# EAGLE design WifiBoxPCB (EAGLE 9.2.2)
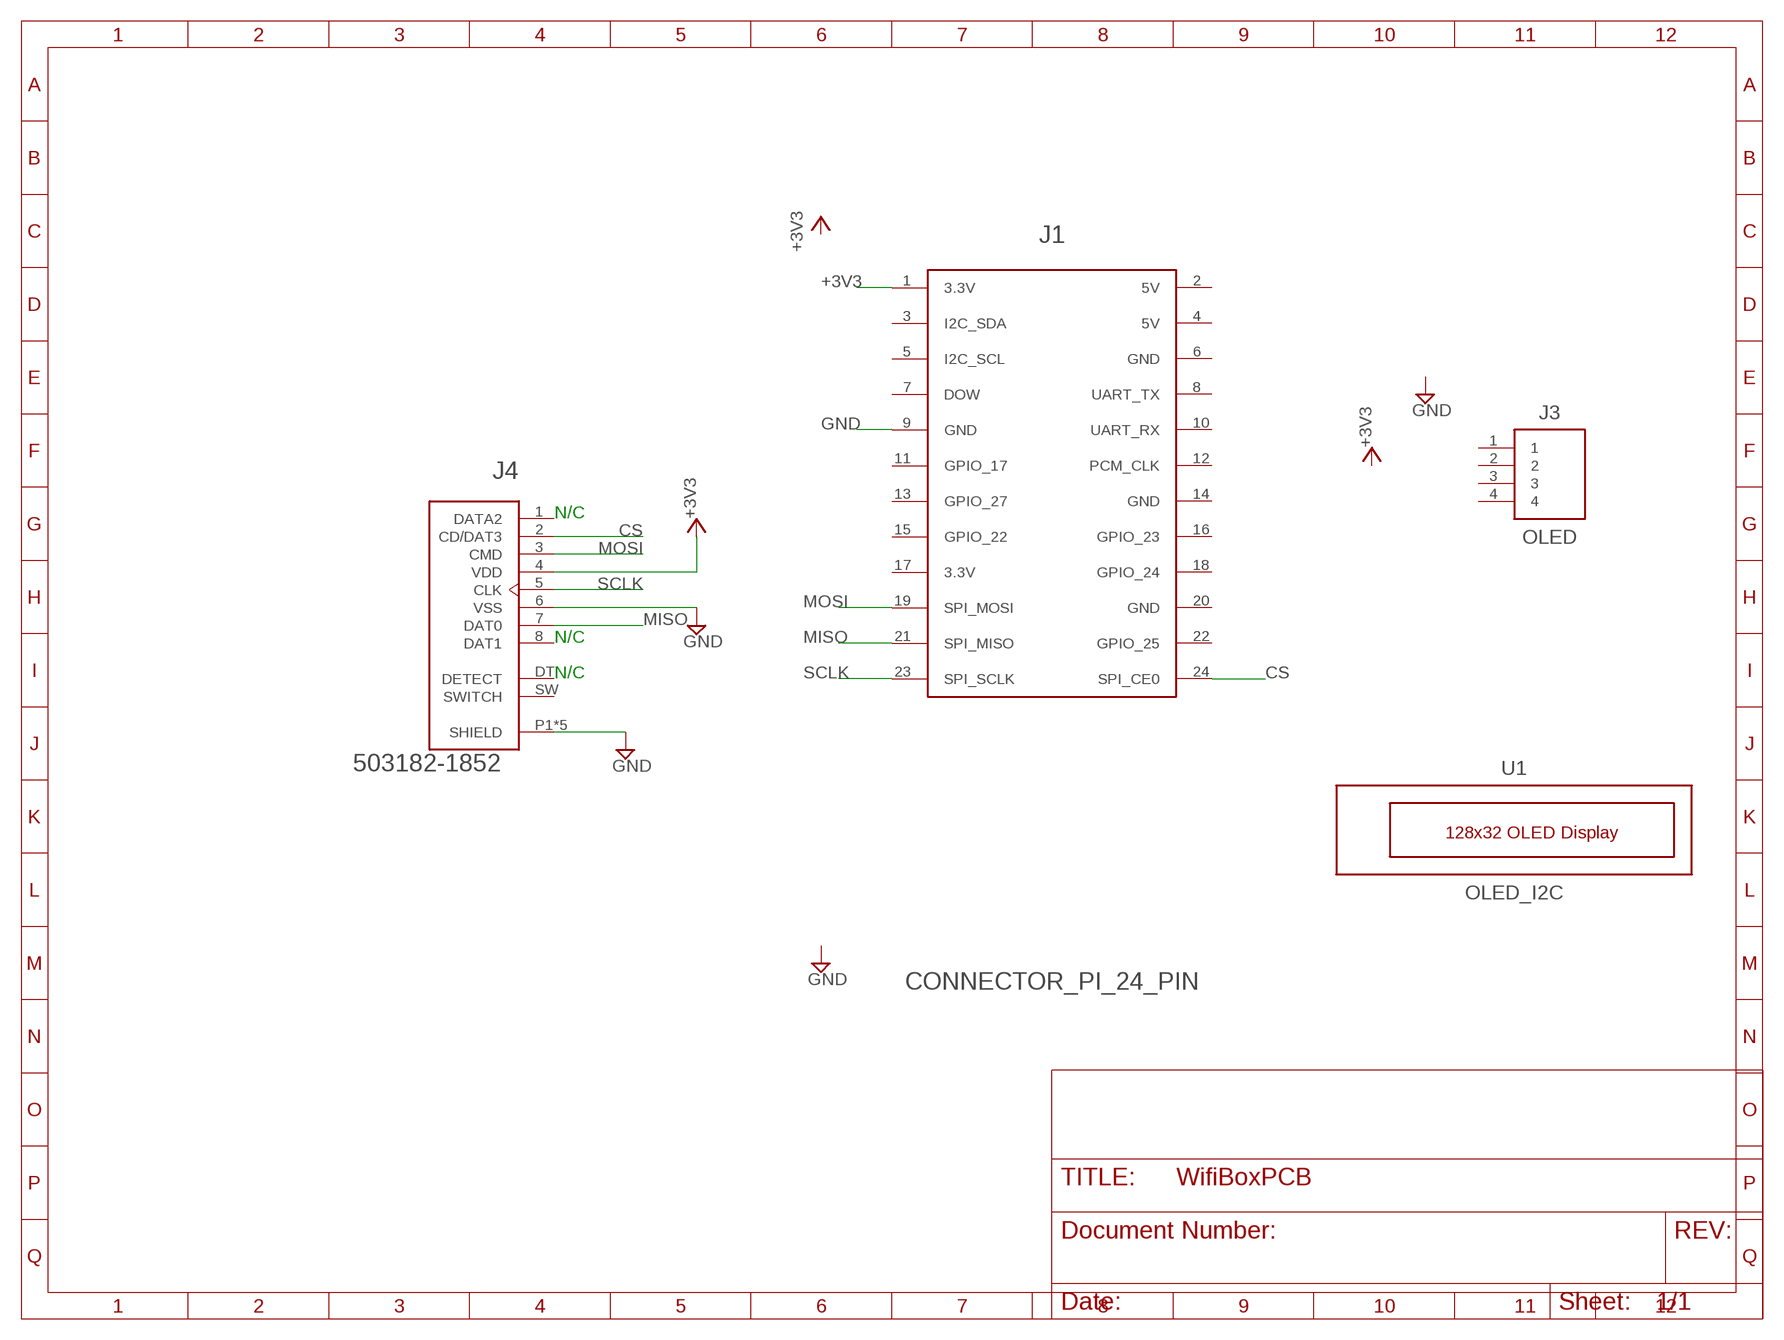
[diagram p0: schematic, sheet 1]

## Parts
J1  CONNECTOR_PI_24_PIN  [2X12]
J3  OLED  CONNECTOR_4  [ESQ-104-XX-X-S]
J4  503182-1852  [MOLEX_503182-1852]
U1  OLED_I2C  [OLED-I2C]

## Nets
+3V3: J1.1(3.3V) J4.4(VDD)
CS: J1.24(SPI_CE0) J4.2(CD/DAT3)
GND: J1.9(GND) J4.6(VSS) J4.P1(SHIELD) J4.P2(SHIELD) J4.P3(SHIELD) J4.P4(SHIELD) J4.P5(SHIELD)
MISO: J1.21(SPI_MISO) J4.7(DAT0)
MOSI: J1.19(SPI_MOSI) J4.3(CMD)
SCLK: J1.23(SPI_SCLK) J4.5(CLK)
Unconnected: J1.2(5V) J1.3(I2C_SDA) J1.4(5V) J1.5(I2C_SCL) J1.6(GND) J1.7(DOW) J1.8(UART_TX) J1.10(UART_RX) J1.11(GPIO_17) J1.12(PCM_CLK) J1.13(GPIO_27) J1.14(GND) J1.15(GPIO_22) J1.16(GPIO_23) J1.17(3.3V) J1.18(GPIO_24) J1.20(GND) J1.22(GPIO_25) J3.1 J3.2 J3.3 J3.4 J4.1(DATA2) J4.8(DAT1) J4.DT(DETECT) J4.SW(SWITCH)

## Notes on the sheet
- N/C
- N/C
- N/C

## Library data of the parts
J1 = ConnectBox_2019:CONNECTOR_PI_24_PIN
J3 = ConnectBox_2019:CONNECTOR_4
J4 = ConnectBox_2019:503182-1852: Conn Micro SD Card M 8 POS 1.09mm Solder RA SMD Embossed T/R 0.5A/Contact; DESCRIPTION: MICRO SD NORMAL ULTRALOWPRO8CKTE; DIGI-KEY_PART_NUMBER: WM12834CT-ND; DIGI-KEY_PURCHASE_URL: https://www.digikey.com/product-detail/en/molex/5031821852/WM12834CT-ND/5823232?utm_source=snapeda&utm_medium=aggregator&utm_campaign=symbol; MF: Molex; MP: 5031821852; PACKAGE: None
U1 = ConnectBox_2019:OLED_I2C

## Board
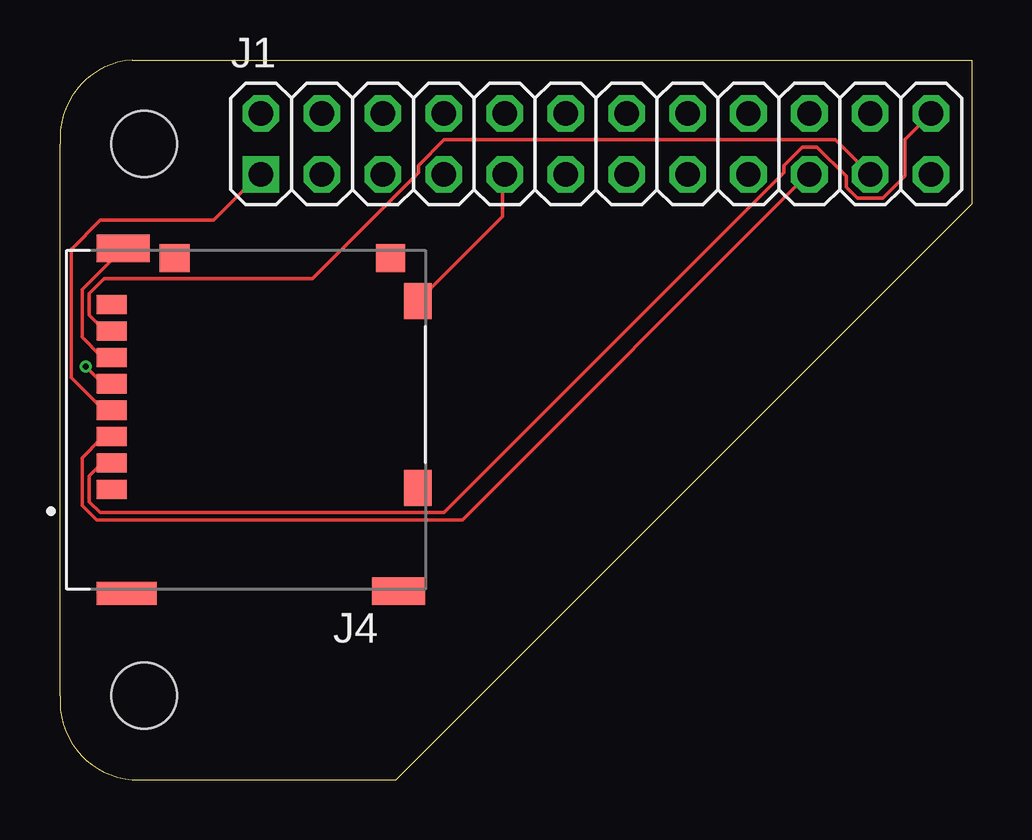
[diagram p1: board, top side]
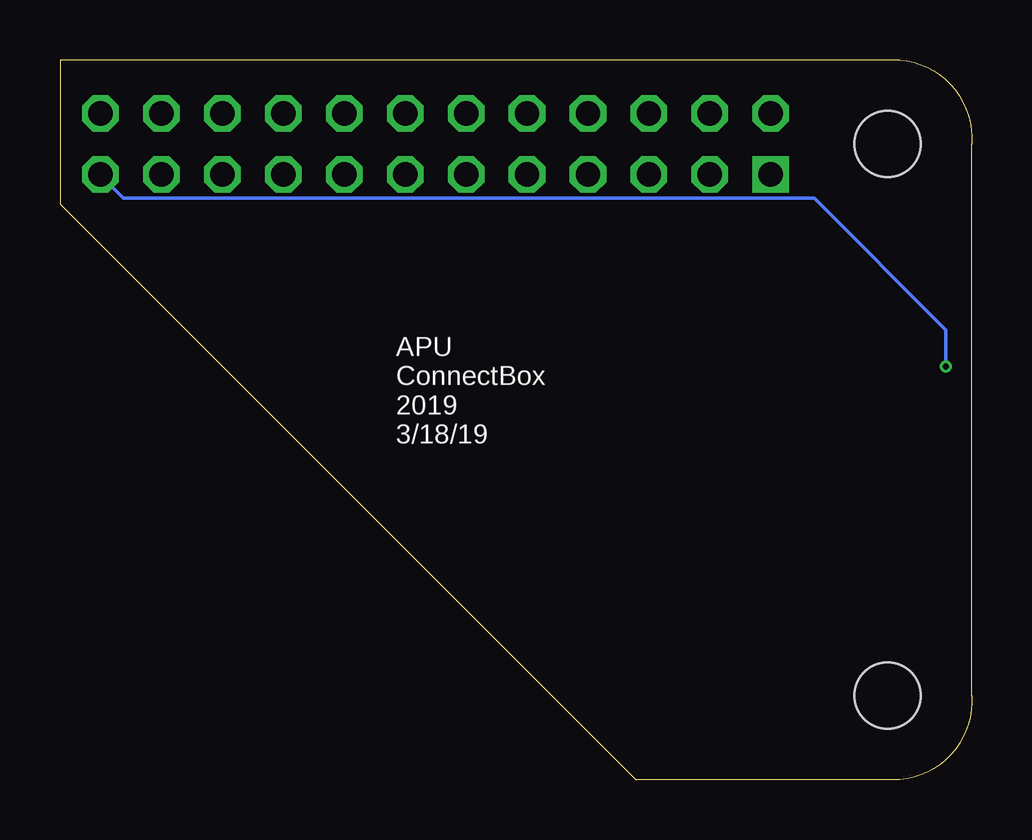
[diagram p2: board, bottom side, seen from below]

Size 38.01 x 30 mm. Coordinates in mm from the lower left corner, seen from the top.
Outline: 0.01,3.5 arc90 3.01,0 14.01,0 38.01,24 38.01,30 3.01,30 arc90 0.01,26.5 0.01,3.5
Copper layers (1*16): Top 0.035559375mm / dielectric 1.6mm / Bottom 0.035559375mm
Design rules "oshpark-2layer": minimum track width 6mil, minimum drill 10mil, track to track 6mil, track to pad 6mil, pad to pad 6mil, via to via 6mil, smd to smd 6mil, copper to edge 15mil, drill to drill 6mil, minimum pad ring 5mil, minimum via ring 5mil, stop-mask expansion 2.5mil, vias tented up to drill 0mil, thermal gap 10mil
Holes 2.75 mm at 3.51,3.5 3.51,26.5
bKeepout: area 0.4,0.4 to 6.6,6.6; area 0.4,23.4 to 6.6,29.6
tRestrict: area 0.4,0.4 to 6.6,6.6; area 0.4,23.4 to 6.6,29.6

### Footprints (pad centres in the part's own frame; a part is rotated, then mirrored left to right if it is on the bottom)
2X12 = drill 1.016 square: 1 -24.13,-1.27 | drill 1.016 octagon: 2 -24.13,1.27; 3 -21.59,-1.27; 4 -21.59,1.27; 5 -19.05,-1.27; 6 -19.05,1.27; 7 -16.51,-1.27; 8 -16.51,1.27; 9 -13.97,-1.27; 10 -13.97,1.27; 11 -11.43,-1.27; 12 -11.43,1.27; 13 -8.89,-1.27; 14 -8.89,1.27; 15 -6.35,-1.27; 16 -6.35,1.27; 17 -3.81,-1.27; 18 -3.81,1.27; 19 -1.27,-1.27; 20 -1.27,1.27; 21 1.27,-1.27; 22 1.27,1.27; 23 3.81,-1.27; 24 3.81,1.27
ESQ-104-XX-X-S = drill 1.016 pad 1.524 square: 1 -3.81,0 | drill 1.016 pad 1.524: 2 -1.27,0; 3 1.27,0; 4 3.81,0
MOLEX_503182-1852 = smd 0.8 x 1.24: 1 -2.9,6.355; 2 -1.8,6.355; 3 -0.7,6.355; 4 0.4,6.355; 5 1.5,6.355; 6 2.6,6.355; 7 3.7,6.355; 8 4.8,6.355 | smd 1.16 x 1.2: DT 6.74,-5.275 | smd 0.95 x 2.5: P1 -7.245,5.725 | smd 1.15 x 2.2: P2 7.145,5.875; P3 -7.145,-5.605 | smd 1.5 x 1.15: P4 -2.84,-6.4; P5 4.94,-6.4 | smd 1.16 x 1.25: SW 6.74,3.725

### Placement (x,y rotation side)
J1  32.51,26.5 0 top
J3  13.79,-8.5 90 top  (outside the outline)
J4  8.51,15 90 top
U1  35.51,-9 0 top  (outside the outline)

### Tracks (layer width: path | path; a pad name or v marks a point on that pad's centre or on a via)
+3V3
  Top 0.152: J4.4 2.14,15.54 1.69,15.54 0.47,16.76 0.47,22.1 1.69,23.32 6.41,23.32 8.24,25.15 J1.1
CS
  Top 0.152: J4.2 2.14,13.11 1.69,13.11 1.23,12.65 1.23,11.58 1.69,11.12 16.01,11.12 30.18,25.3 30.18,25.6 30.95,26.36 31.56,26.36 32.78,25.15 32.78,24.69 33.23,24.23 34.3,24.23 35.21,25.15 35.21,26.67 36.28,27.74 J1.24
GND
  Top 0.152: J4.6 2.14,17.68 1.69,17.68 0.92,18.44 0.92,20.42 2.6,22.1 J4.P2 | J1.9 18.45,25.15 18.45,23.47 14.94,19.96 J4.P5
MISO
  Top 0.152: J4.7 2.14,18.75 1.84,18.75 1.23,19.36 1.23,20.27 1.84,20.88 10.53,20.88 14.94,25.3 14.94,25.6 16.01,26.67 32.32,26.67 33.69,25.3 J1.21
MOSI
  Top 0.152: J4.3 2.14,14.17 1.69,14.17 0.92,13.41 0.92,11.43 1.53,10.82 16.77,10.82 31.1,25.15 J1.19
SCLK  (via drill 0.25)
  Top 0.152: v1.08,17.22 1.69,16.61 2.14,16.61 J4.5
  Bottom 0.152: v1.08,17.22 1.08,18.75 6.56,24.23 35.37,24.23 36.28,25.15 J1.23

### Text on the board
Top: Top
Bottom: Bottom
bPlace: APU / ConnectBox / 2019 / 3/18/19